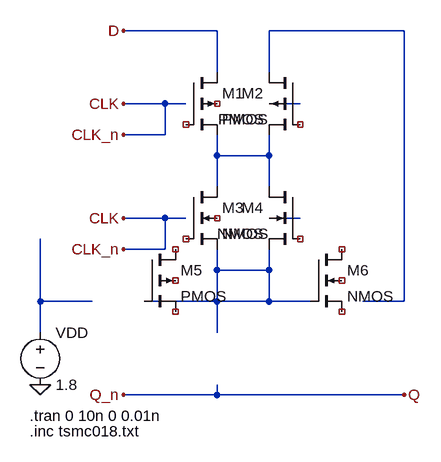
[diagram p0: schematic D-Flip-Flop (1).asc]
D-Flip-Flop (1).asc, the LTspice schematic file:
Version 4
SHEET 1 880 680
WIRE 112 48 -32 48
WIRE 400 48 192 48
WIRE 112 112 112 48
WIRE 192 112 192 48
WIRE 32 160 -32 160
WIRE 64 160 32 160
WIRE 240 160 192 160
WIRE 32 208 32 160
WIRE 32 208 -32 208
WIRE 112 240 112 208
WIRE 192 240 192 208
WIRE 192 240 112 240
WIRE 112 288 112 240
WIRE 192 288 192 240
WIRE 32 336 -32 336
WIRE 64 336 32 336
WIRE 240 336 192 336
WIRE 32 384 32 336
WIRE 32 384 -32 384
WIRE 112 416 112 384
WIRE 192 416 192 384
WIRE 192 416 112 416
WIRE -160 464 -160 368
WIRE -80 464 -160 464
WIRE 112 464 112 416
WIRE 112 464 0 464
WIRE 192 464 192 416
WIRE 192 464 112 464
WIRE 256 464 192 464
WIRE 400 464 400 48
WIRE 400 464 336 464
WIRE -160 512 -160 464
WIRE 112 512 112 464
WIRE 112 608 112 592
WIRE 112 608 -32 608
WIRE 400 608 112 608
FLAG -160 592 0
FLAG -32 48 D
FLAG -32 160 CLK
FLAG -32 208 CLK_n
FLAG -32 336 CLK
FLAG -32 384 CLK_n
FLAG -32 608 Q_n
FLAG 400 608 Q
SYMBOL pmos4 64 112 R0
SYMATTR InstName M1
SYMATTR Value2 l=0.18u w=0.9u
SYMBOL pmos4 240 112 M0
SYMATTR InstName M2
SYMATTR Value2 l=0.18u w=0.9u
SYMBOL nmos4 64 288 R0
SYMATTR InstName M3
SYMATTR Value2 l=0.18u w=0.45u
SYMBOL nmos4 240 288 M0
SYMATTR InstName M4
SYMATTR Value2 l=0.18u w=0.45u
SYMBOL voltage -160 496 R0
WINDOW 123 0 0 Left 0
WINDOW 39 0 0 Left 0
SYMATTR InstName VDD
SYMATTR Value 1.8
SYMBOL pmos4 0 384 R0
SYMATTR InstName M5
SYMATTR Value2 l=0.18u w=0.9u
SYMBOL nmos4 256 384 R0
SYMATTR InstName M6
SYMATTR Value2 l=0.18u w=0.45u
TEXT -176 640 Left 2 !.tran 0 10n 0 0.01n
TEXT -176 664 Left 2 !.inc tsmc018.txt

The netlist it stands for:
* D-Flip-Flop (1).asc
* M1: PMOS l=0.18u w=0.9u (symbol pmos4 not certain, pin order unknown); nets seen at it: D, N003
* M2: PMOS l=0.18u w=0.9u (symbol pmos4 not certain, pin order unknown); nets seen at it: N001, N002, N003
* M3: NMOS l=0.18u w=0.45u (symbol nmos4 not certain, pin order unknown); nets seen at it: N003, N005
* M4: NMOS l=0.18u w=0.45u (symbol nmos4 not certain, pin order unknown); nets seen at it: N003, N004, N005
VDD N006 0 1.8
M5 NC_07 N005 NC_08 NC_09 PMOS l=0.18u w=0.9u
M6 NC_10 N005 NC_11 NC_12 NMOS l=0.18u w=0.45u
.model NMOS NMOS
.model PMOS PMOS
.lib standard.mos
.tran 0 10n 0 0.01n
.inc tsmc018.txt
.backanno
.end